# EAGLE schematic basis (EAGLE 6.6.0)
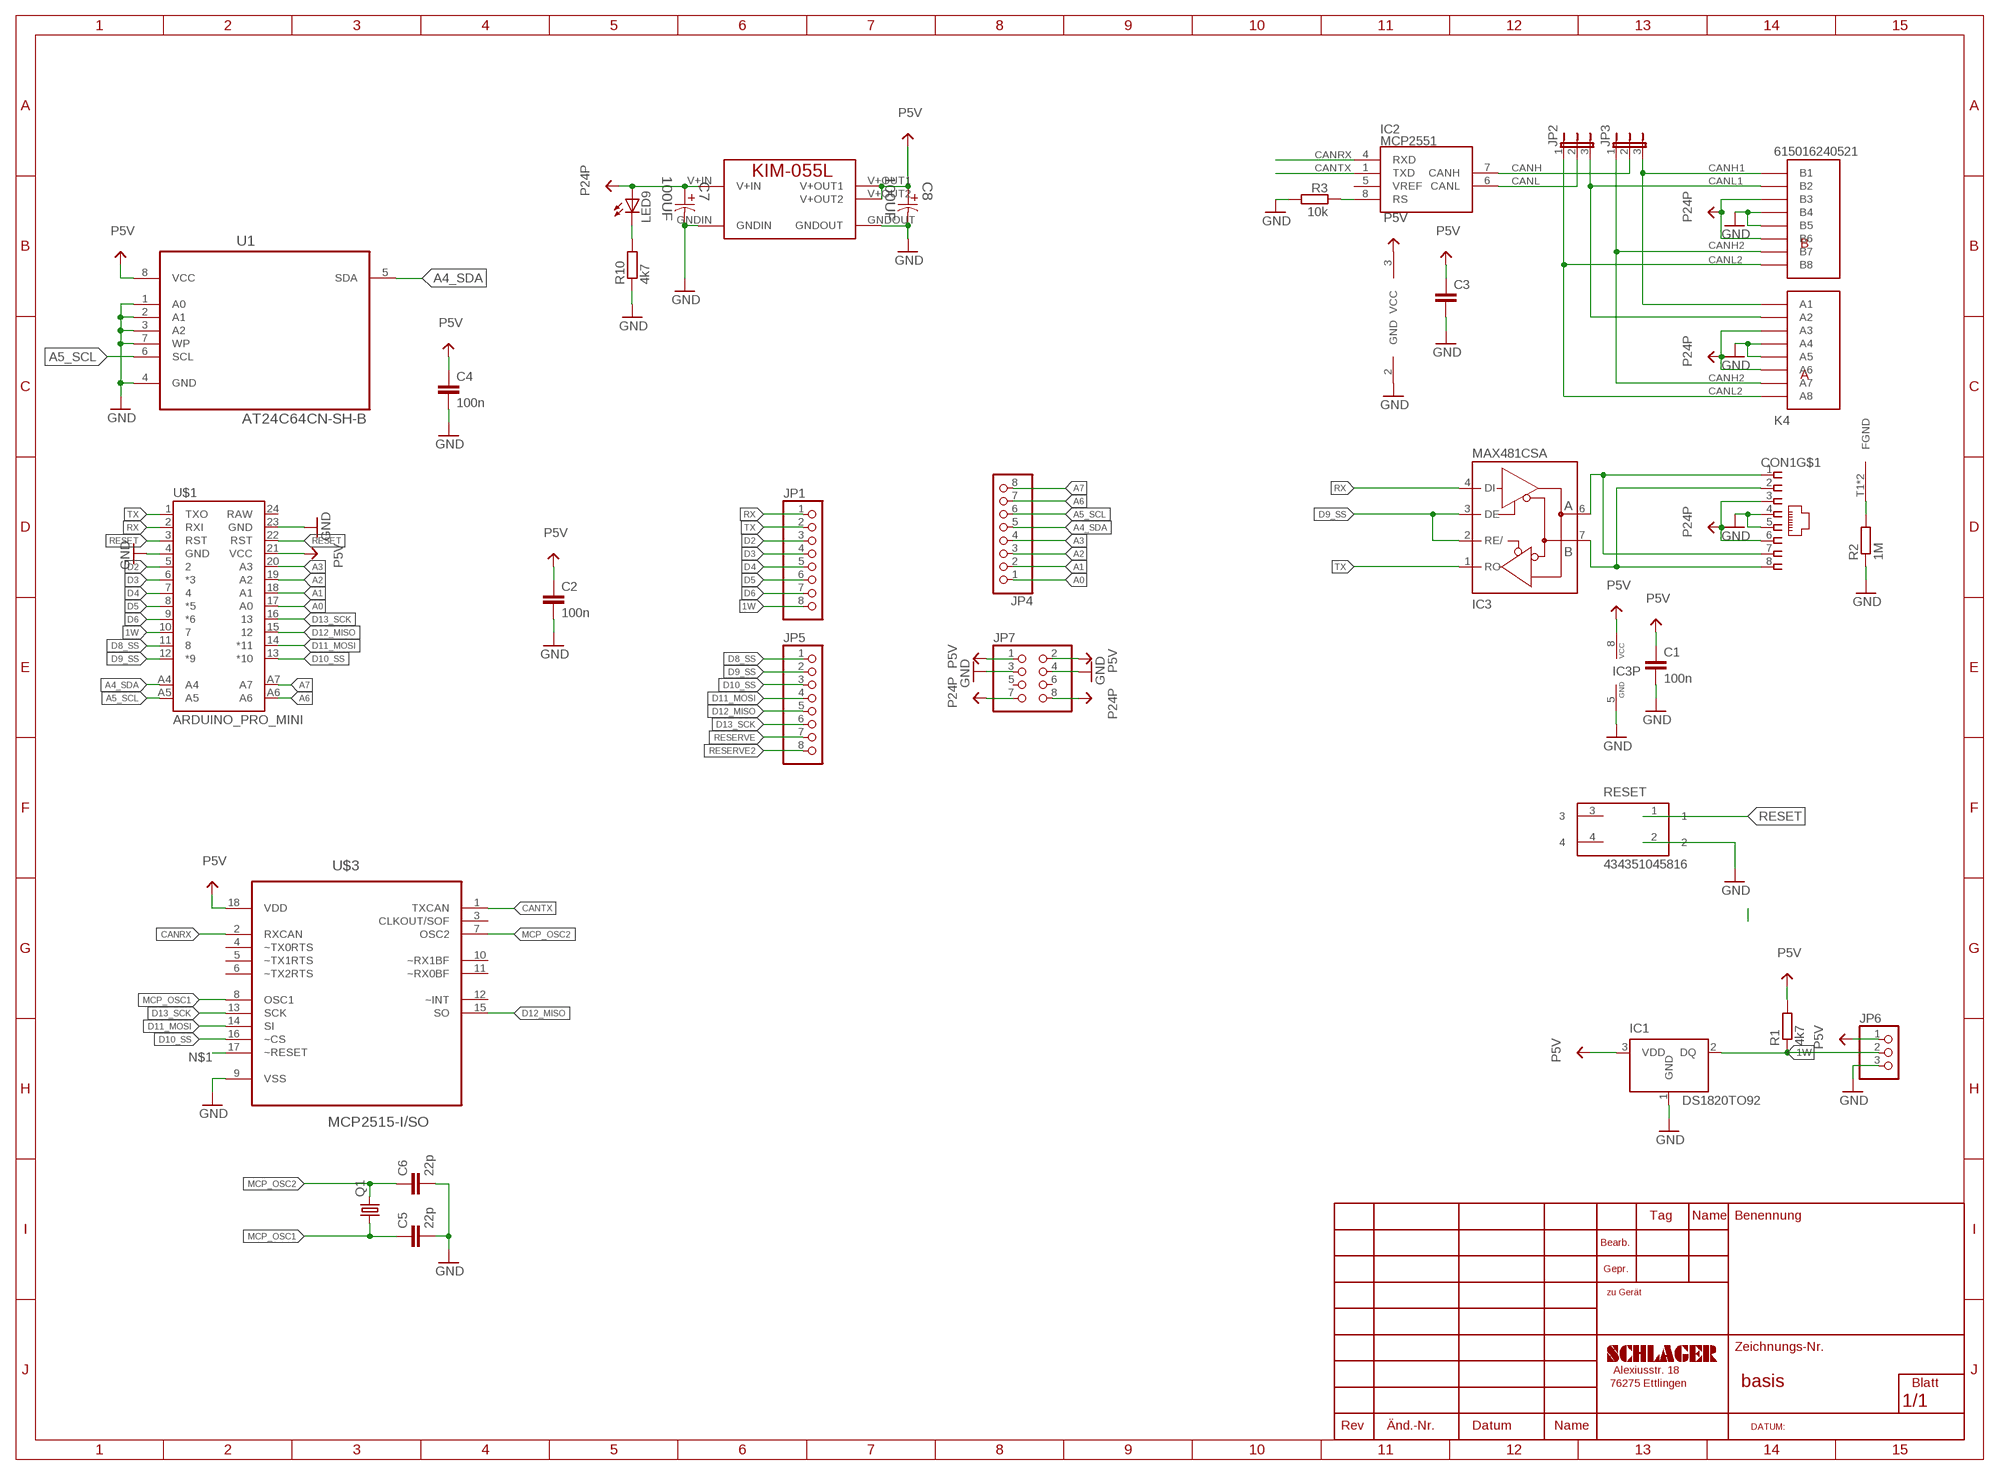
[diagram p0: schematic, sheet 1]

## Parts
C1  100n  C-EUC0805  [C0805]
C2  100n  C-EUC0805  [C0805]
C3  C-EUC0805  [C0805]
C4  100n  C-EUC0805  [C0805]
C5  22p  C-EUC0805  [C0805]
C6  22p  C-EUC0805  [C0805]
C7  100UF  EEE-FK1V101P-CASE-F  [CAPAE830X1050N]
C8  100UF  EEE-FK1V101P-CASE-F  [CAPAE830X1050N]
CON1  MEBP_8-8G  [MEBP]
IC1  DS1820TO92  [TO-92]
IC2  MCP2551  [SO-8]
IC3  MAX481CSA  [SO08]
JP1  PINHD-1X8  [1X08]
JP2  JP2E  [JP2]
JP3  JP2E  [JP2]
JP4  PINHD-1X8  [1X08]
JP5  PINHD-1X8  [1X08]
JP6  PINHD-1X3/90  [1X03/90]
JP7  PINHD-2X4  [2X04]
K4  615016240521  [615016240521]
LED9  LED3MM  [LED3MM]
MOD1  KIM-055L  [KIM-055L]
Q1  CRYSTALHC49S  [HC49/S]
R1  4k7  R-EU_M0805  [M0805]
R2  1M  R-EU_R0805  [R0805]
R3  10k  R-EU_R0603  [R0603]
R10  4k7  R-EU_R0805  [R0805]
RESET  434351045816  [434351045816]
U1  AT24C64CN-SH-B  [SOIC127P600X175-8N]
U$1  ARDUINO_PRO_MINI  [ARDUINO_PRO_MINI]
U$3  MCP2515-I/SO  [SOIC127P1034X264-18N]

## Nets
1W: IC1.2(DQ) JP1.8 JP6.2 R1.1 U$1.10
A0: JP4.1 U$1.17(A0)
A1: JP4.2 U$1.18(A1)
A2: JP4.3 U$1.19(A2)
A3: JP4.4 U$1.20(A3)
A4_SDA: JP4.5 U1.5(SDA) U$1.A4
A5_SCL: JP4.6 U1.6(SCL) U$1.A5
A6: U$1.A6
A7: U$1.A7
CANH: IC2.7(CANH) JP3.2
CANH1: JP3.3 K4.A1 K4.B1
CANH2: JP3.1 K4.A7 K4.B7
CANL: IC2.6(CANL) JP2.2
CANL1: JP2.3 K4.A2 K4.B2
CANL2: JP2.1 K4.A8 K4.B8
CANRX: IC2.4(RXD) U$3.2(RXCAN)
CANTX: IC2.1(TXD) U$3.1(TXCAN)
D2: JP1.3 U$1.5
D3: JP1.4 U$1.6(*3)
D4: JP1.5 U$1.7
D5: JP1.6 U$1.8(*5)
D6: JP1.7 U$1.9(*6)
D8_SS: JP5.1 U$1.11
D9_SS: IC3.2(RE/) IC3.3(DE) JP5.2 U$1.12(*9)
D10_SS: JP5.3 U$1.13(*10) U$3.16(~CS)
D11_MOSI: JP5.4 U$1.14(*11) U$3.14(SI)
D12_MISO: JP5.5 U$1.15 U$3.15(SO)
D13_SCK: JP5.6 U$1.16 U$3.13(SCK)
GND: C1.2 C2.2 C3.2 C4.2 C5.2 C6.2 C7.2 C8.2 CON1.4 CON1.5 IC1.1(GND) IC2.2(GND) IC3.5(GND) JP6.3 JP7.3 JP7.4 K4.A4 K4.A5 K4.B4 K4.B5 MOD1.GNDIN MOD1.GNDOUT R2.1 R3.2 R10.1 RESET.2 U1.1(A0) U1.2(A1) U1.3(A2) U1.4(GND) U1.7(WP) U$1.4(GND) U$1.23(GND) U$3.9(VSS)
MCP_OSC1: C5.1 Q1.1 U$3.8(OSC1)
MCP_OSC2: C6.1 Q1.2 U$3.7(OSC2)
N$1: U$3.17(~RESET)
N$2: IC2.8(RS) R3.1
N$3: CON1.T1(FGND) CON1.T2(FGND) R2.2
N$9: LED9.K(C) R10.2
P5V: C1.1 C2.1 C3.1 C4.1 C8.1 IC1.3(VDD) IC2.3(VCC) IC3.8(VCC) JP6.1 JP7.1 JP7.2 MOD1.V+OUT1 MOD1.V+OUT2 R1.2 U1.8(VCC) U$1.21(VCC) U$3.18(VDD)
P24P: C7.1 CON1.3 CON1.6 JP7.7 JP7.8 K4.A3 K4.A6 K4.B3 K4.B6 LED9.A MOD1.V+IN
RESERVE: JP5.7
RESERVE2: JP5.8
RESET: RESET.1 U$1.3(RST) U$1.22(RST)
RS485_A: CON1.1 CON1.7 IC3.6(A)
RS485_B: CON1.2 CON1.8 IC3.7(B)
RX: IC3.4(DI) JP1.1 U$1.2(RXI)
TX: IC3.1(RO) JP1.2 U$1.1(TXO)
Unconnected: IC2.5(VREF) JP4.7 JP4.8 JP7.5 JP7.6 RESET.3 RESET.4 U$1.24(RAW) U$3.3(CLKOUT/SOF) U$3.4(~TX0RTS) U$3.5(~TX1RTS) U$3.6(~TX2RTS) U$3.10(~RX1BF) U$3.11(~RX0BF) U$3.12(~INT)

## Library data of the parts
C1-C6 = schlager_passiv:C-EU: CAPACITOR, European symbol
C7 C8 = PASSIV_Panasonic-EEEFK_EEEFP:EEE-: Aluminum Electrolytic Capacitors,Surface Mount Type; MPN: EEE-FK1V101P; OC_FARNELL: 9695869; OC_NEWARK: 82K7638; PACKAGE: CASE-F; SUPPLIER: PANASONIC; TOLERANCE: ±20 %; VOLTAGERATING: 35V
CON1 = myconn:MEBP_8-8G: Reichelt RJ45 geschirmt MEBP 8-8G
IC1 = schlager_ics:DS1820: DS1820 - 1-Wire Digital Thermometer
IC2 = MYMCHIP:MCP2551: CAN Transceiver
IC3 = maxim:MAX481CSA: RS485 TRANSEIVER; MF: MAXIM; MPN: MAX481CSA; OC_FARNELL: unknown; OC_NEWARK: 90C3817
JP1 JP4 JP5 = pinhead:PINHD-1X8: PIN HEADER
JP2 JP3 = jumper:JP2E: JUMPER
JP6 = pinhead:PINHD-1X3: PIN HEADER
JP7 = pinhead:PINHD-2X4: PIN HEADER
K4 = Wuerth_Elektronik_eiCan_Communication_Connectors:615016240521: WR-MJ Horizontal Shielded Dual Stacked Port with EMI Panel Finger 8P8C Modular Jack Tab Up & Down, 16 Pins
LED9 = led:LED: LED OSRAM: - CHIPLED LG R971, LG N971, LY N971, LG Q971, LY Q971, LO R971, LY R971 LH N974, LH R974 LS Q976, LO Q976, LY Q976 LO Q996 - Hyper CHIPLED LW Q18S LB Q993, LB Q99A, LB R99A - SideLED LS A670, LO A670, LY A670, LG A670, LP A670 LB A673, LV A673, LT A673, LW A673 LH A674 LY A675 LS A676, LA A676, LO A676, LY A676, LW A676 LS A679, LY A679, LG A679 - Hyper Micro SIDELED® LS Y876, LA Y876, LO Y876, LY Y876 LT Y87S - SmartLED LW L88C, LW L88S LB L89C, LB L89S, LG L890 LS L89K, LO L89K, LY L89K LS L896, LA L896, LO L896, LY L896 - TOPLED LS T670, LO T670, LY T670, LG T670, LP T670 LSG T670, LSP T670, LSY T670, LOP T670, LYG T670 LG T671, LOG T671, LSG T671 LB T673, LV T673, LT T673, LW T673 LH T674 LS T676, LA T676, LO T676, LY T676, LB T676, LH T676, LSB T676, LW T676 LB T67C, LV T67C, LT T67C, LS T67K, LO T67K, LY T67K, LW E67C LS E67B, LA E67B, LO E67B, LY E67B, LB E67C, LV E67C, LT E67C LW T67C LS T679, LY T679, LG T679 LS T770, LO T770, LY T770, LG T770, LP T770 LB T773, LV T773, LT T773, LW T773 LH T774 LS E675, LA E675, LY E675, LS T675 LS T776, LA T776, LO T776, LY T776, LB T776 LHGB T686 LT T68C, LB T68C - Hyper Mini TOPLED® LB M676 - Mini TOPLED Santana® LG M470 LS M47K, LO M47K, LY M47K Source: http://www.osram.convergy.de LUXEON: - LUMILED® LXK2-PW12-R00, LXK2-PW12-S00, LXK2-PW14-U00, LXK2-PW14-V00 LXK2-PM12-R00, LXK2-PM12-S00, LXK2-PM14-U00 LXK2-PE12-Q00, LXK2-PE12-R00, LXK2-PE12-S00, LXK2-PE14-T00, LXK2-PE14-U00 LXK2-PB12-K00, LXK2-PB12-L00, LXK2-PB12-M00, LXK2-PB14-N00, LXK2-PB14-P00, LXK2-PB14-Q00 LXK2-PR12-L00, LXK2-PR12-M00, LXK2-PR14-Q00, LXK2-PR14-R00 LXK2-PD12-Q00, LXK2-PD12-R00, LXK2-PD12-S00 LXK2-PH12-R00, LXK2-PH12-S00 LXK2-PL12-P00, LXK2-PL12-Q00, LXK2-PL12-R00 Source: www.luxeon.com KINGBRIGHT: KA-3528ASYC Source: www.kingbright.com
MOD1 = kim055l:KIM-055L: 5V 5amp DC DC module. IMPORANT: Add low ESR input & output capacitors. V+OUT1 & V+OUT2 internally connected.
Q1 = crystal:CRYSTAL: CRYSTAL; OC_FARNELL: 1667008; OC_NEWARK: unknown
R1 R2 R10 = schlager_passiv:R-EU_: RESISTOR, European symbol
R3 = rcl:R-EU_: RESISTOR, European symbol
RESET = Illuminated_Switches:434351045816: WS-TUS-3.5x4.7 mm side push SMD Tact Switch, 4 pins
U1 = Atmel_By_element14_Batch_1-00:AT24C64CN-SH-B: Two-wire Serial EEPROM; MPN: AT24C64CN-SH-B; OC_FARNELL: 1362658; OC_NEWARK: -; PACKAGE: SOIC-8; SUPPLIER: Atmel
U$1 = SparkFun-Boards:ARDUINO_PRO_MINI
U$3 = schlager_ics:MCP2515-I/SO: CAN Controller; MPN: MCP2515-I/SO; OC_FARNELL: 1292239; OC_NEWARK: 29H7136; PACKAGE: SOIC-18; SUPPLIER: Microchip

## Net classes
4 USBpair: width 0.254 mm, drill 0.406 mm, clearance 0.508 mm